# Altium schematic sheet PreInputAmplifierCircuit.SchDoc
size A
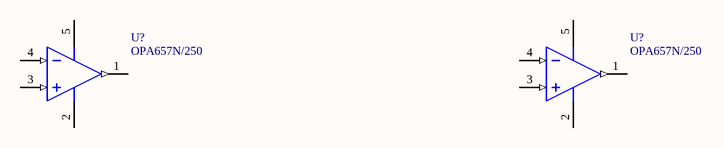
[diagram p0: PreInputAmplifierCircuit.SchDoc]

## Parts
(Parts that share a designator on the sheet are numbered #1, #2 ... from top to bottom, then left to right.)
U?#1  OPA657N/250  [DBV0005A_L]
U?#2  OPA657N/250  [DBV0005A_L]

## Nets

Not connected (* = marked no-connect by the designer): U?#1 1(OUT) 2(VS-) 3(IN+) 4(IN-) 5(VS+); U?#2 1(OUT) 2(VS-) 3(IN+) 4(IN-) 5(VS+)

## Library data of the parts
U?#1 U?#2 = CMP-0018-00416-2: 1.6 GHz, Low Noise, Fet-Input Operational Amplifier, 8 to 12 V, -40 to 85 degC, 5-pin SOT23 (DBV5), Green (RoHS & no Sb/Br); Manufacturer: Texas Instruments; THD (Fc is 1 MHz)(Typ)(dB): -72; Vs(Min)(V): 8; Iq per channel(Max)(mA): 16.3; Number of Channels: 1; 3rd Harmonic(dBc): 106; BW @ Acl(MHz): 340; @ MHz: 5; 2nd Harmonic(dBc): 74; Sub Family: High Output Current Amplifier (>=50mA), High Speed Amplifier (>=50MHz); Acl, min stable gain(V/V): 7; Vs(Max)(V): 12; Iib(Max)(nA): 0.02; Vio(Max)(mV): 0.6; Io(Typ)(mA): 70; Settling Time (0.1%)(Typ)(ns): 11; Slew Rate(Typ)(V/us): 700; DatasheetVersion: SBOS197E; ComponentLink2Description: Datasheet; ComponentLink2URL: http://www.ti.com/general/docs/lit/getliterature.tsp?genericPartNumber=OPA657&fileType=pdf; PackageVersion: 4073253-4/K, 03/2006; PartNumber: OPA657N/250; PackageDescription: 5-Pin Plastic Small Outline, Body 1.6 x 2.9 mm, Pitch 0.95 mm; ComponentLink3Description: Package Specification; Code_JEDEC: MO-178; PackageReference: DBV0005A; ComponentLink1URL: http://www.ti.com/; Mounting Technology: Surface Mount; ComponentLink3URL: http://www.ti.com/litv/pdf/mpds018i; Vn at Flatband(Typ)(nV/rtHz): 5; ComponentLink1Description: Manufacturer URL; Eco-Plan: Green (RoHS & no Sb/Br)